# Altium schematic sheet BV100011_Ethernet.SchDoc: Ethernet PHY with RJ45 connector
size A4; Date: 25-FEB-2015; Author: A.B; CompanyName: STMicroelectronics; Address1: 12, Rue Jules HOROWITZ; Address2: 38019 Grenoble; Address3: FRANCE; DocumentNumber: MB1191; Revision: B-02; SheetNumber: 12; SheetTotal: 14; Project: STM32F746G-DISCO
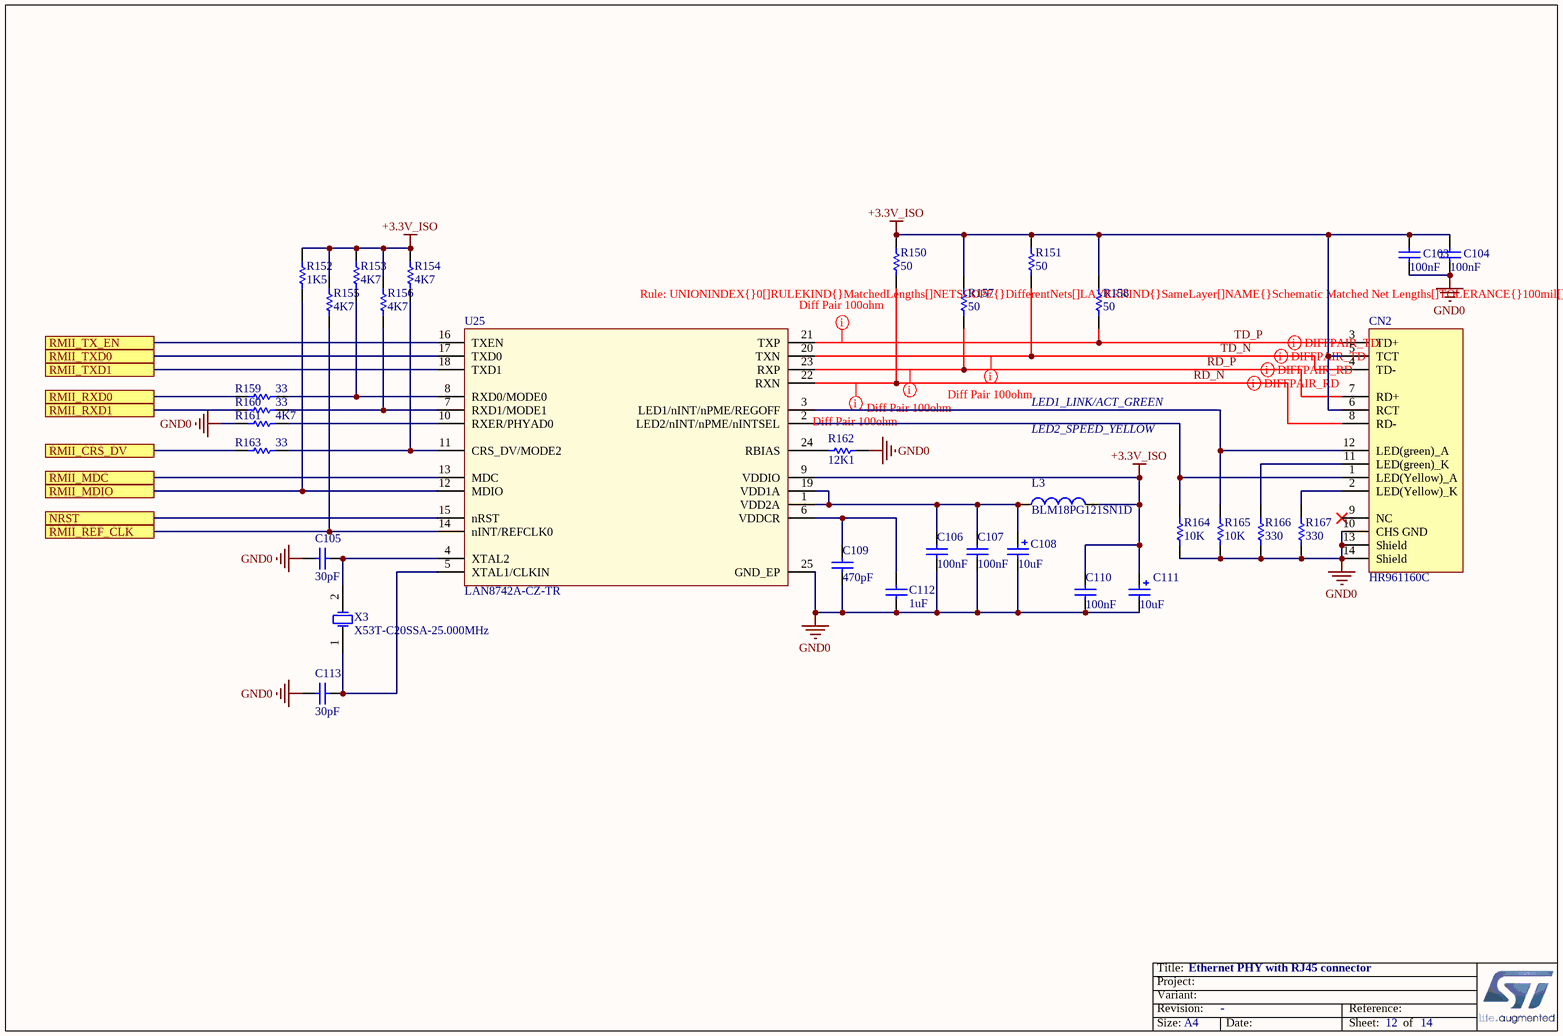
[diagram p0: BV100011_Ethernet.SchDoc]

## Parts
C103  100nF  [0402C]
C104  100nF  [0402C]
C105  30pF  [0603C]
C106  100nF  [0402C]
C107  100nF  [0402C]
C108  10uF  [TAN-A]
C109  470pF  [0402C]
C110  100nF  [0402C]
C111  10uF  [TAN-A]
C112  1uF  [0603C]
C113  30pF  [0603C]
CN2  HR961160C  [RJ45_HR961160C]
L3  BLM18PG121SN1D  [0603L]
R150  50  [0402R]
R151  50  [0402R]
R152  1K5  [0402R]
R153  4K7  [0402R]
R154  4K7  [0402R]
R155  4K7  [0402R]
R156  4K7  [0402R]
R157  50  [0402R]
R158  50  [0402R]
R159  33  [0402R]
R160  33  [0402R]
R161  4K7  [0402R]
R162  12K1  [0603R]
R163  33  [0402R]
R164  10K  [0402R]
R165  10K  [0402R]
R166  330  [0402R]
R167  330  [0402R]
U25  LAN8742A-CZ-TR  [QFN24_0R5_4X4]
X3  X53T-C20SSA-25.000MHz  [XTAL_2SM_5R0X3R2]

## Ports
NRST, RMII_CRS_DV, RMII_MDC, RMII_MDIO, RMII_REF_CLK, RMII_RXD0, RMII_RXD1, RMII_TX_EN, RMII_TXD0, RMII_TXD1

## Nets
+3.3V_ISO: C103.2 C104.2 C110.2 C111.1 CN2.5(TCT) CN2.6(RCT) L3.2 R150.1 R151.1 R152.2 R153.2 R154.2 R155.2 R156.2 R157.1 R158.1 U25.9(VDDIO)
GND0: C103.1 C104.1 C105.2 C106.1 C107.1 C108.2 C109.1 C110.1 C111.2 C112.1 C113.2 CN2.10(CHS_GND) CN2.13(Shield) CN2.14(Shield) R161.2 R162.2 R164.1 R165.1 R166.1 R167.1 U25.25(GND_EP)
NRST: U25.15(nRST) ; port NRST
RD_N: CN2.8(RD-) R150.2 U25.22(RXN)
RD_P: CN2.7(RD+) R157.2 U25.23(RXP)
RMII_CRS_DV: R163.2 ; port RMII_CRS_DV
RMII_MDC: U25.13(MDC) ; port RMII_MDC
RMII_MDIO: R152.1 U25.12(MDIO) ; port RMII_MDIO
RMII_REF_CLK: R155.1 U25.14(nINT/REFCLK0) ; port RMII_REF_CLK
RMII_RXD0: R159.2 ; port RMII_RXD0
RMII_RXD1: R160.2 ; port RMII_RXD1
RMII_TX_EN: U25.16(TXEN) ; port RMII_TX_EN
RMII_TXD0: U25.17(TXD0) ; port RMII_TXD0
RMII_TXD1: U25.18(TXD1) ; port RMII_TXD1
TD_N: CN2.4(TD-) R151.2 U25.20(TXN)
TD_P: CN2.3(TD+) R158.2 U25.21(TXP)
NetC105_1: C105.1 U25.4(XTAL2) X3.2(OSC2)
NetC106_2: C106.2 C107.2 C108.1 L3.1 U25.1(VDD2A) U25.19(VDD1A)
NetC109_2: C109.2 C112.2 U25.6(VDDCR)
NetC113_1: C113.1 U25.5(XTAL1/CLKIN) X3.1(OSC1)
NetCN2_1: CN2.1(LED(Yellow)_A) R164.2 U25.2(LED2/nINT/nPME/nINTSEL)
NetCN2_2: CN2.2(LED(Yellow)_K) R167.2
NetCN2_11: CN2.11(LED(green)_K) R166.2
NetCN2_12: CN2.12(LED(green)_A) R165.2 U25.3(LED1/nINT/nPME/REGOFF)
NetR153_1: R153.1 R159.1 U25.8(RXD0/MODE0)
NetR154_1: R154.1 R163.1 U25.11(CRS_DV/MODE2)
NetR156_1: R156.1 R160.1 U25.7(RXD1/MODE1)
NetR161_1: R161.1 U25.10(RXER/PHYAD0)
NetR162_1: R162.1 U25.24(RBIAS)

Not connected (* = marked no-connect by the designer): CN2 9(NC)*

## Layout directives
differential pair: RD_N, RD_P, TD_N, TD_P
rule Matched Net Lengths [Tolerance = 100mil]: RD_N, RD_P, TD_N, TD_P

## Notes on the sheet
- LED2_SPEED_YELLOW
- LED1_LINK/ACT_GREEN
- Title:
- Project:
- Size:
- Revision:
- Variant:
- A4
- -
- Date:
- Reference:
- Sheet:
- of

## Library data of the parts
C103 C104 C106 C107 C110 = Cap_100nF_X7R_10%_0402: Capacitor,100nF,16V,X7R,10%,0402,YAGEO; Manuf_Part_1: CC0402KRX7R7BB104; Revision: July-2002: Re-released for DXP Platform.; Value: 100nF; Order: CC0402KRX7R7BB104; Manuf_1: YAGEO
C105 C113 = Capacitor_ST: Capacitor 0402 / 0603 / 0805; Value: 100nF; Revision: July-2002: Re-released for DXP Platform.
C108 C111 = Cap_10uF_POL_10%_TANA: Polarized Capacitor,10uF,10V,10%,typeA,VISHAY; Manuf_Part_1: 293D106X9010A2TE3; Revision: July-2002: Re-released for DXP Platform.; Value: 10uF; Manuf_1: VISHAY; Order: *; ECCN_US/EU: n/a
C109 = Cap_470pF_X7R_10%_0402: Capacitor,470pF,16V,X7R,10%,0402,YAGEO; Manuf_Part_1: 0402YC471KAT4A; Manuf_1: AVX; Revision: July-2002: Re-released for DXP Platform.; Value: 470pF; Order: 0402YC471KAT4A; ECCN_US/EU: n/a
C112 = Cap_1uF_X5R_10%_0603: Capacitor,1uF,16V,X5R,10%,0603,YAGEO; Manuf_Part_1: CC0603KRX5R7BB105; Revision: July-2002: Re-released for DXP Platform.; Value: 1uF; Order: CC0603KRX5R7BB105; Manuf_1: YAGEO; ECCN_US/EU: n/a
CN2 = HR961160C: 100 Base-TX (Fast Ethernet) SMD RJ45 single port (1x1) with LEDS Integrated Magnetics Connector; Manuf_1: HanRun; Manuf_2: Pulse Electronics Corporation; Manuf_Part_2: J3011G21DNLT; Manuf_3: K.O.D International Holding; Manuf_Part_3: RMT-119A-12F6-GY-04; Distrib: Sub Co; Manuf_Part_1: HR961160C; Order: *
L3 = BEAD_120R_2A_0603: Bead,120R,2A,0603,BLM18PG121SN1D,MURATA; Manuf_Part_3: FCM1608KF-601T03; Manuf_2: TDK; Manuf_Part_2: MPZ1608S300A; Manuf_3: Tai-tech; Value: 100uH; Description_3: Bead,600R,350mA,0603,FCM1608KF-601T03,Tai-tech; Description_2: Bead,30R,5A,0603,MPZ1608S300A,TDK; Revision: July-2002: Re-released for DXP Platform.; ECCN_US/EU: n/a; Manuf_Part_1: BLM18PG121SN1D; Manuf_1: MURATA
R150 R151 R157 R158 = Res_50_1%_0402: Resistor,50,0402,1%,YAGEO; Manuf_Part_1: RC0402FR-0749R9L; Value: 49.9; Manuf_1: YAGEO; Order: *; ECCN_US/EU: n/a; Distrib: FARNELL
R152 = Res_1K5_1%_0402: Resistor,1K5,0402,1%,YAGEO; Manuf_Part_1: RC0402FR-071K5L; Value: 1K5; Manuf_1: YAGEO; Order: RC0402FR-071K5L; ECCN_US/EU: n/a; Distrib: FARNELL
R153-R156 R161 = Res_4K7_1%_0402: Resistor,4K7,0402,1%,YAGEO; Manuf_Part_1: RT0402FRE074K7L; Value: 4K7; Manuf_1: YAGEO; Order: RT0402FRE074K7L; ECCN_US/EU: n/a
R159 R160 R163 = Res_33_1%_0402: Resistor,33,0402,1%,YAGEO; Manuf_Part_1: RC0402FR-0733RL; Value: 33; Manuf_1: YAGEO; Order: *; ECCN_US/EU: n/a; Distrib: FARNELL
R162 = Res_12K1_1%_0603: Resistor,12K1,0603,1%,VISHAY; Manuf_Part_1: MCT 0603-50 1% P5 12K1; Order: 2325243; Value: 12K1; ECCN_US/EU: n/a; Manuf_1: VISHAY; Distrib: FARNELL
R164 R165 = Res_10K_1%_0402: Resistor,10K,0402,1%,YAGEO; Manuf_Part_1: RC0402FR-0710KL; Value: 10K; Manuf_1: YAGEO; Order: RC0402FR-0710KL; ECCN_US/EU: n/a
R166 R167 = Res_330_1%_0402: Resistor,330,0402,1%,YAGEO; Manuf_Part_1: RC0402FR-07330RL; Value: 330; ECCN_US/EU: n/a; Manuf_1: YAGEO; Distrib: DIGIKEY; Order: RC0402FR-07330RL
U25 = LAN8742A-CZ-TR: LAN8742A-CZ-TR - Small Footprint RMII 10/100 Ethernet, Transceiver with HP Auto-MDIX and flexPWR Technology SQFN-24; Manuf_1: MICROCHIP; Order: LAN8742A-CZ-TR; Manuf_Part_1: LAN8742A-CZ-TR; Distrib: MICROCHIP
X3 = XTAL_5032: Crystal Oscillator; Published: 8-Jun-2000; LatestRevisionDate: 17-Jul-2002; LatestRevisionNote: Re-released for DXP Platform.; PackageReference: R38; Publisher: Altium Limited